# EAGLE design rev3 (EAGLE 7.2.0)
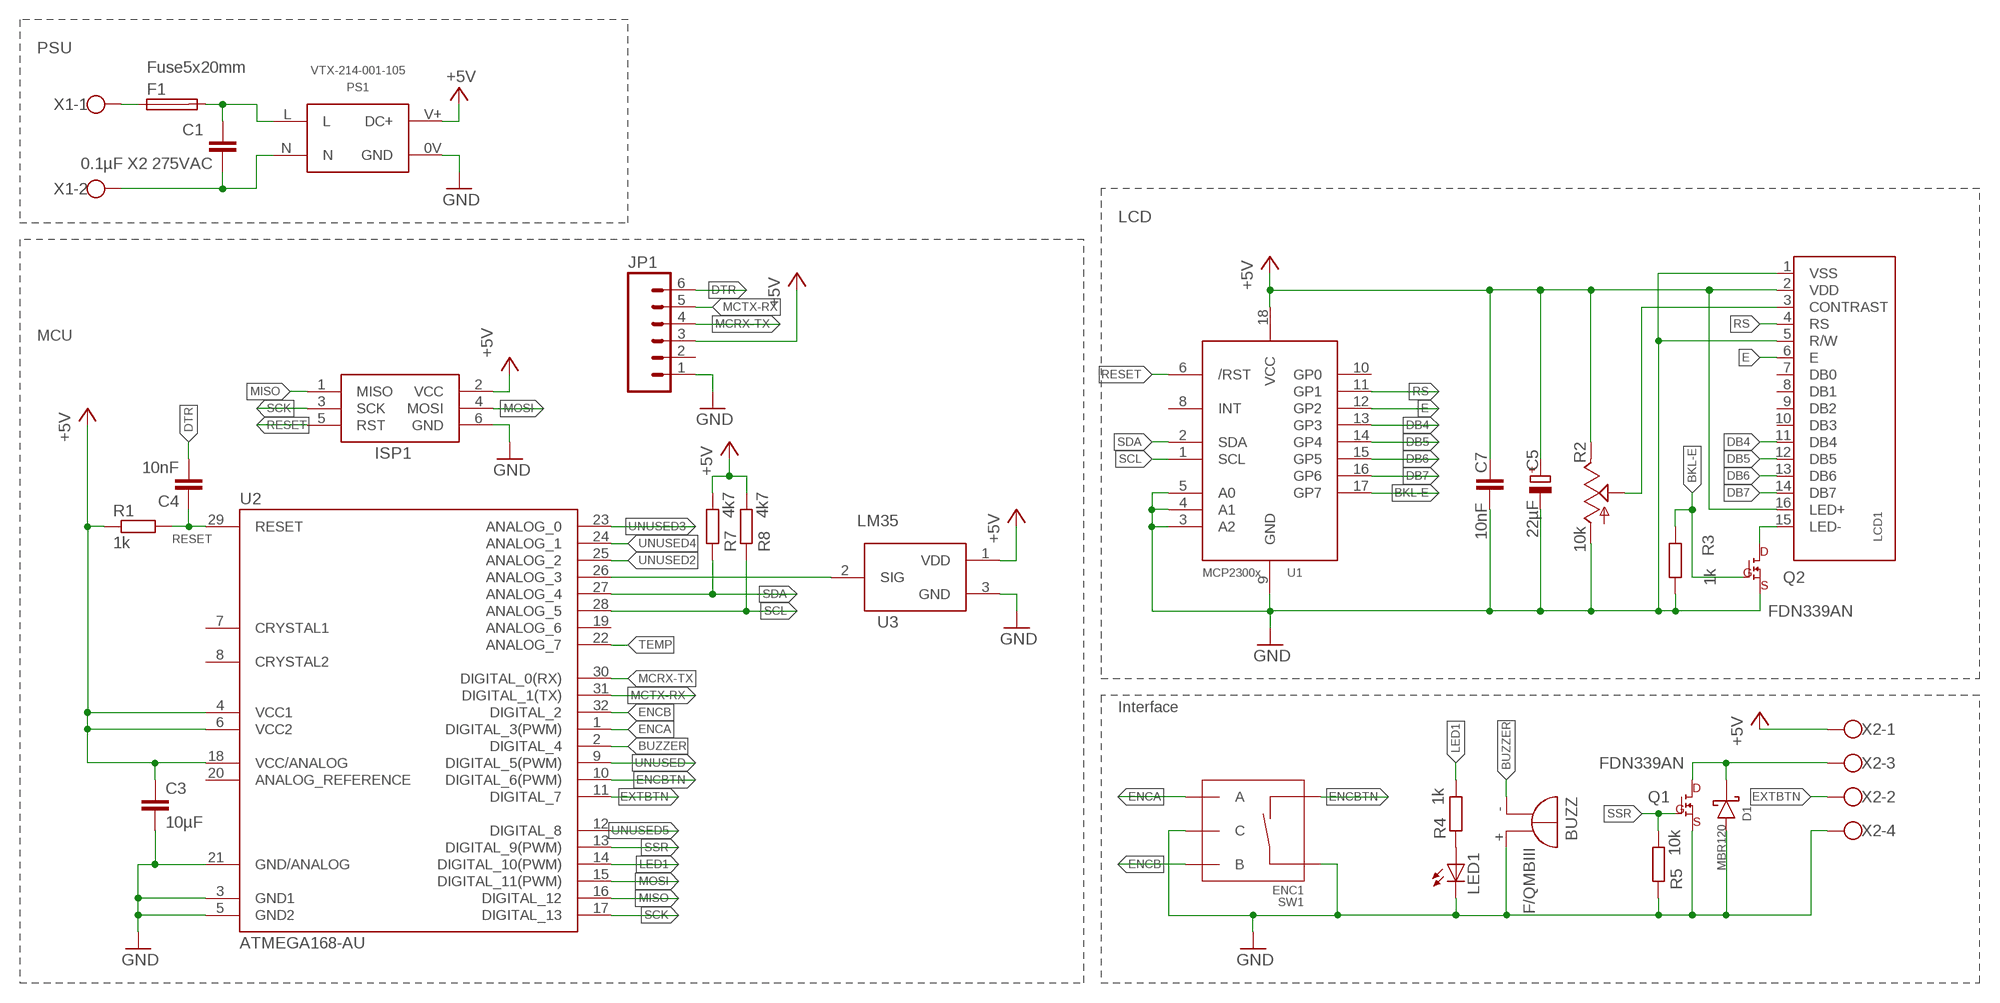
[diagram p0: schematic, sheet 1]

## Parts
BUZZ  F/QMBIII  [F/QMBIII]
C1  0.1µF X2 275VAC  C-EU102-064X133  [C102-064X133]
C3  10µF  C-EUC3216  [C3216]
C4  10nF  C-EUC1206K  [C1206K]
C5  22µF  CPOL-EUE2,5-6E  [E2,5-6E]
C7  10nF  C-EUC1206K  [C1206K]
D1  MBR120  [SOD-123FL]
F1  Fuse5x20mm  FUSEBLANK_5X20MM  [FUSE_HOLDER_5X20MM]
ISP1  AVRISP-6  [AVRISP]
JP1  M06LOCK  [1X06_LOCK]
LCD1  HD44780-LCD  [8X2-CHARLCD]
LED1  LED5MM  [LED5MM]
PS1  VTX-214-001-105  [VTX-214-001-]
Q1  FDN339AN  [SOT23]
Q2  FDN339AN  [SOT23]
R1  1k  R-EU_R0603  [R0603]
R2  10k  TRIM_US-B64Y  [B64Y]
R3  1k  R-EU_R0603  [R0603]
R4  1k  R-EU_R0603  [R0603]
R5  10k  R-EU_R0603  [R0603]
R7  4k7  R-EU_R0603  [R0603]
R8  4k7  R-EU_R0603  [R0603]
SW1  ENC1  ROTARTY_ENCODER  [ROTARY_ENC_PLAIN]
U1  MCP2300X/SO  [SO18W]
U2  ATMEGA168-AU  [TQFP32-08]
U3  LM35  [TO92-]
X1  W237-113  [W237-113]
X2  W237-4  [W237-4]

## Nets
+5V: C3.1 C5.+ C7.1 ISP1.2(VCC) JP1.3 LCD1.2(VDD) LCD1.16(LED+) PS1.V+(DC+) R1.1 R2.E R7.2 R8.2 U1.18(VCC) U2.4(VCC1) U2.6(VCC2) U2.18(VCC/ANALOG) U3.1(VDD) X2.1
BKL-E: Q2.1(GATE) R3.1 U1.17(GP7)
BUZZER: BUZZ.-(+) U2.2(DIGITAL_4)
DB4: LCD1.11(DB4) U1.13(GP3)
DB5: LCD1.12(DB5) U1.14(GP4)
DB6: LCD1.13(DB6) U1.15(GP5)
DB7: LCD1.14(DB7) U1.16(GP6)
DTR: C4.2 JP1.6
E: LCD1.6(E) U1.12(GP2)
ENCA: SW1.A U2.1(DIGITAL_3(PWM))
ENCB: SW1.B U2.32(DIGITAL_2)
ENCBTN: SW1.SW- U2.10(DIGITAL_6(PWM))
EXTBTN: U2.11(DIGITAL_7) X2.2
GND: BUZZ.+(-) C3.2 C5.- C7.2 D1.A ISP1.6(GND) JP1.1 LCD1.1(VSS) LCD1.5(R/W) LED1.K(C) PS1.0V(GND) Q1.2(SOURCE) Q2.2(SOURCE) R2.A R3.2 R5.1 SW1.C SW1.SW+ U1.3(A2) U1.4(A1) U1.5(A0) U1.9(GND) U2.3(GND1) U2.5(GND2) U2.21(GND/ANALOG) U3.3(GND) X2.4
LED1: R4.2 U2.14(DIGITAL_10(PWM))
MCRX-TX: JP1.4 U2.30(DIGITAL_0(RX))
MCTX-RX: JP1.5 U2.31(DIGITAL_1(TX))
MISO: ISP1.1(MISO) U2.16(DIGITAL_12)
MOSI: ISP1.4(MOSI) U2.15(DIGITAL_11(PWM))
N$1: LCD1.3(CONTRAST) R2.S
N$2: F1.1 X1.1
N$3: C1.1 F1.2 PS1.L
N$4: LCD1.15(LED-) Q2.3(DRAIN)
N$5: U2.26(ANALOG_3) U3.2(SIG)
N$6: LED1.A R4.1
N$7: C1.2 PS1.N X1.2
N$8: D1.C Q1.3(DRAIN) X2.3
RESET: C4.1 ISP1.5(RST) R1.2 U1.6(/RST) U2.29(RESET)
RS: LCD1.4(RS) U1.11(GP1)
SCK: ISP1.3(SCK) U2.17(DIGITAL_13)
SCL: R8.1 U1.1(SCL) U2.28(ANALOG_5)
SDA: R7.1 U1.2(SDA) U2.27(ANALOG_4)
SSR: Q1.1(GATE) R5.2 U2.13(DIGITAL_9(PWM))
TEMP: U2.22(ANALOG_7)
UNUSED: U2.9(DIGITAL_5(PWM))
UNUSED2: U2.25(ANALOG_2)
UNUSED3: U2.23(ANALOG_0)
UNUSED4: U2.24(ANALOG_1)
UNUSED5: U2.12(DIGITAL_8)
Unconnected: JP1.2 LCD1.7(DB0) LCD1.8(DB1) LCD1.9(DB2) LCD1.10(DB3) U1.8(INT) U1.10(GP0) U2.7(CRYSTAL1) U2.8(CRYSTAL2) U2.19(ANALOG_6) U2.20(ANALOG_REFERENCE)

## Notes on the sheet
- PSU
- LCD
- MCU
- Interface

## Library data of the parts
BUZZ = buzzer:F/QMBIII: BUZZER Source: Buerklin; OC_FARNELL: unknown; OC_NEWARK: unknown
C1 C3 C4 C7 = resistor:C-EU: CAPACITOR, European symbol
C5 = resistor:CPOL-EU: POLARIZED CAPACITOR, European symbol
D1 = Custom-parts:MBR120
F1 = fuse:FUSE: Fuse; OC_FARNELL: unknown; OC_NEWARK: unknown
ISP1 = adafruit:AVRISP: AVR ISP HEADER Standard 6 pin header for AVR programming
JP1 = SparkFun-Connectors:M06: Header 6 Standard 6-pin 0.1" header. Use with straight break away headers (SKU : PRT-00116), right angle break away headers (PRT-00553), swiss pins (PRT-00743), machine pins (PRT-00117), and female headers (PRT-00115). Molex polarized connector foot print use with SKU : PRT-08094 with associated crimp pins and housings. NOTES ON THE VARIANTS LOCK and LOCK_LONGPADS... This footprint was designed to help hold the alignment of a through-hole component (i.e. 6-pin header) while soldering it into place. You may notice that each hole has been shifted either up or down by 0.005 of an inch from it's more standard position (which is a perfectly straight line). This slight alteration caused the pins (the squares in the middle) to touch the edges of the holes. Because they are alternating, it causes a "brace" to hold the component in place. 0.005 has proven to be the perfect amount of "off-center" position when using our standard breakaway headers. Although looks a little odd when you look at the bare footprint, once you have a header in there, the alteration is very hard to notice. Also, if you push a header all the way into place, it is covered up entirely on the bottom side. This idea of altering the position of holes to aid alignment will be further integrated into the Sparkfun Library for other footprints. It can help hold any component with 3 or more connection pins.
LCD1 = Custom-parts:HD44780-LCD
LED1 = adafruit:LED: LED OSRAM: - CHIPLED LG R971, LG N971, LY N971, LG Q971, LY Q971, LO R971, LY R971 LH N974, LH R974 LS Q976, LO Q976, LY Q976 LO Q996 - Hyper CHIPLED LW Q18S LB Q993, LB Q99A, LB R99A - SideLED LS A670, LO A670, LY A670, LG A670, LP A670 LB A673, LV A673, LT A673, LW A673 LH A674 LY A675 LS A676, LA A676, LO A676, LY A676, LW A676 LS A679, LY A679, LG A679 - Hyper Micro SIDELED® LS Y876, LA Y876, LO Y876, LY Y876 LT Y87S - SmartLED LW L88C, LW L88S LB L89C, LB L89S, LG L890 LS L89K, LO L89K, LY L89K LS L896, LA L896, LO L896, LY L896 - TOPLED LS T670, LO T670, LY T670, LG T670, LP T670 LSG T670, LSP T670, LSY T670, LOP T670, LYG T670 LG T671, LOG T671, LSG T671 LB T673, LV T673, LT T673, LW T673 LH T674 LS T676, LA T676, LO T676, LY T676, LB T676, LH T676, LSB T676, LW T676 LB T67C, LV T67C, LT T67C, LS T67K, LO T67K, LY T67K, LW E67C LS E67B, LA E67B, LO E67B, LY E67B, LB E67C, LV E67C, LT E67C LW T67C LS T679, LY T679, LG T679 LS T770, LO T770, LY T770, LG T770, LP T770 LB T773, LV T773, LT T773, LW T773 LH T774 LS E675, LA E675, LY E675, LS T675 LS T776, LA T776, LO T776, LY T776, LB T776 LHGB T686 LT T68C, LB T68C - Hyper Mini TOPLED® LB M676 - Mini TOPLED Santana® LG M470 LS M47K, LO M47K, LY M47K Source: http://www.osram.convergy.de/
PS1 = Custom-parts:VTX-214-001-
Q1 Q2 = Custom-parts:FDN339AN
R1 R3-R5 R7 R8 = resistor:R-EU_: RESISTOR, European symbol
R2 = pot:TRIM_US-: POTENTIOMETER
SW1 = SparkFun-Electromechanical:ROTARTY_ENCODER: Simple no LED rotary encoder Example: COM-09117
U1 = adafruit:MCP2300X: MCP23008 Inexpensive i2c i/o expander - 8 general purpose i/o pins with optional pullups
U2 = Arduino-AVR:ATMEGA168
U3 = Custom-parts:LM35
X1 = con-wago-500:W237-113: WAGO SCREW CLAMP; OC_FARNELL: unknown; OC_NEWARK: unknown
X2 = con-wago-500:W237-4: WAGO SCREW CLAMP; OC_FARNELL: unknown; OC_NEWARK: unknown

## Board
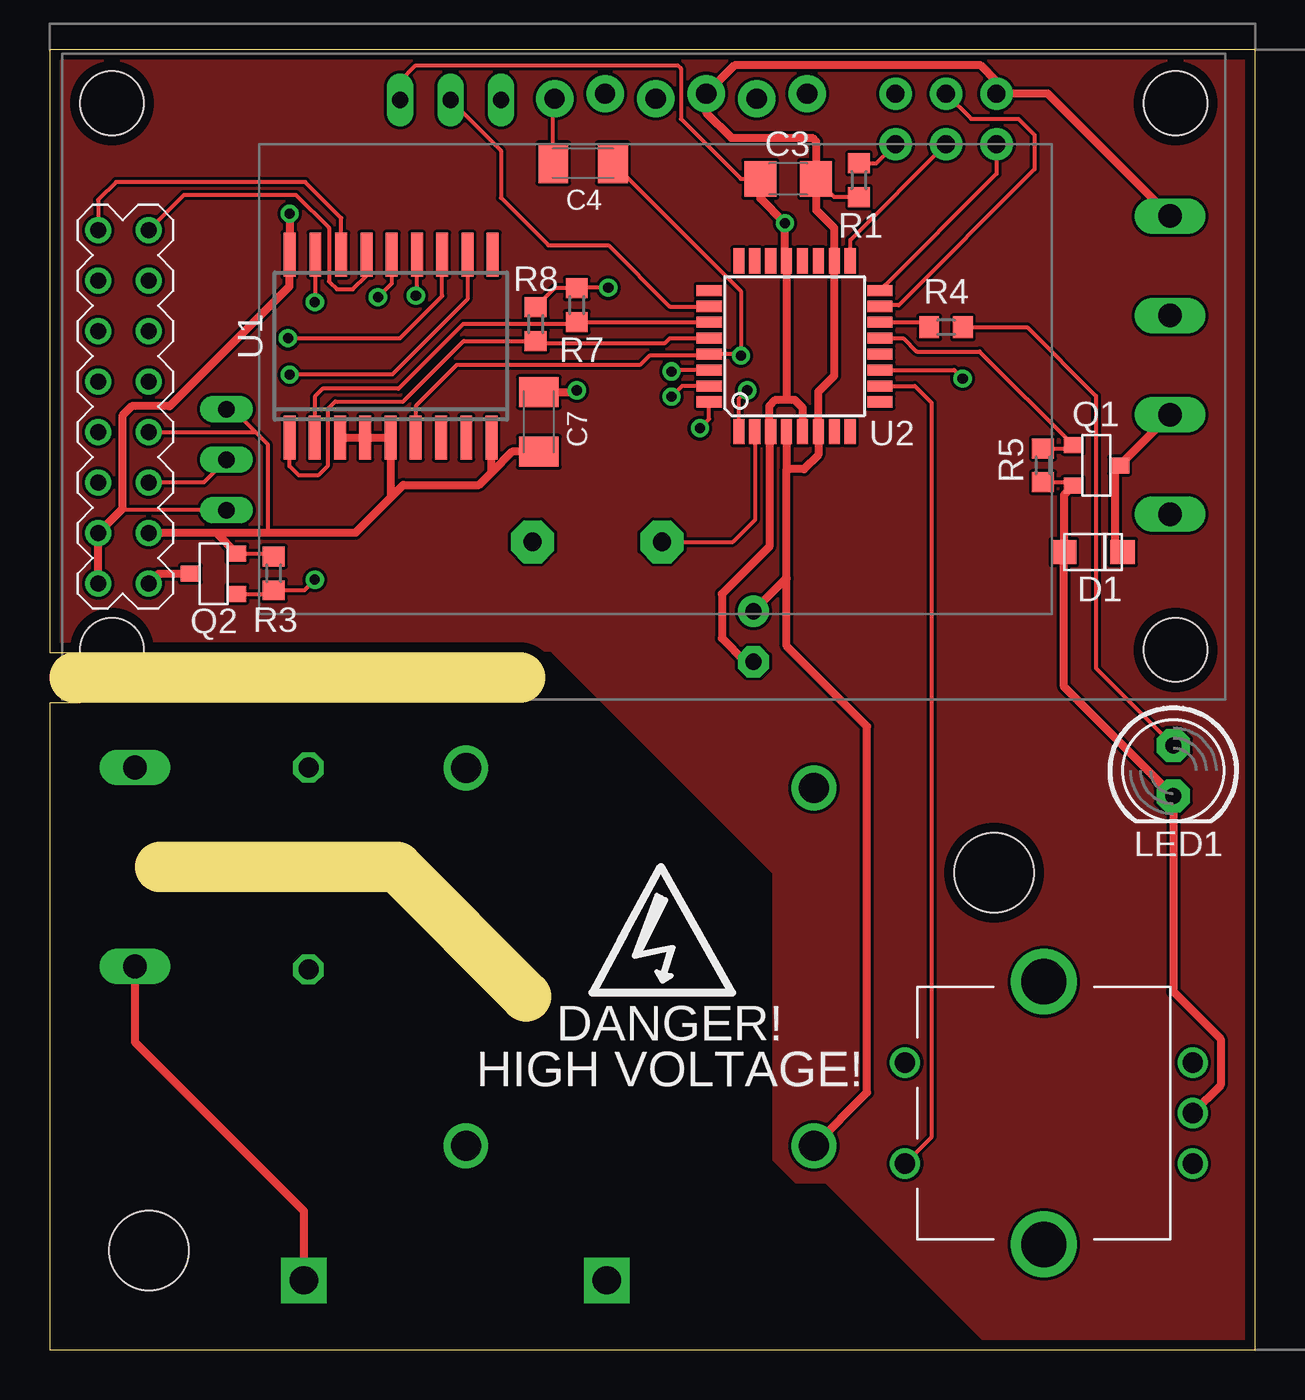
[diagram p1: board, top side]
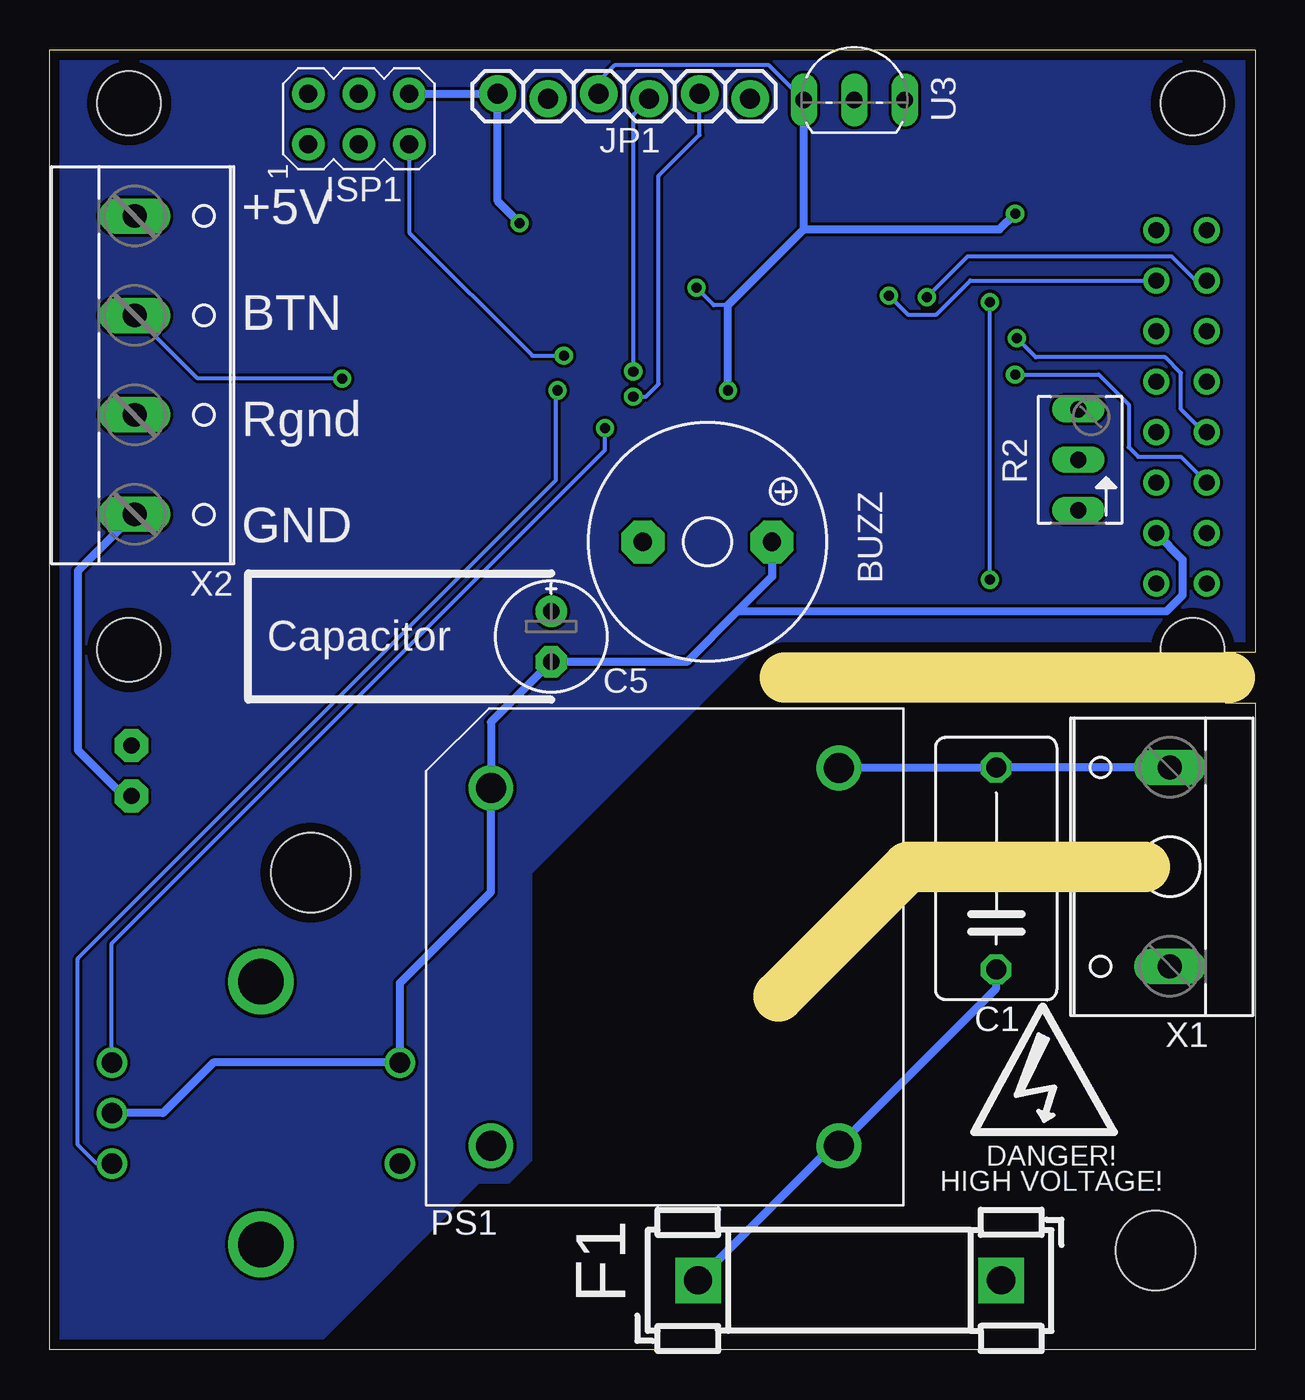
[diagram p2: board, bottom side, seen from below]

Size 60.63 x 65.39 mm. Coordinates in mm from the lower left corner, seen from the top.
Outline: 1.27,33.81 23.65,33.81
Outline: 5.56,24.29 17.46,24.29 23.97,17.78
Outline: 0,0 60.63,0 60.63,65.39 0,65.39 0,35.08 1.51,35.08 1.51,32.54 0,32.54 0,0
Copper layers (1*16): Top 0.035mm / dielectric 1.5mm / Bottom 0.035mm
Design rules "OSH park": minimum track width 6mil, minimum drill 13mil, track to track 6mil, track to pad 6mil, pad to pad 6mil, via to via 6mil, smd to smd 6mil, copper to edge 20mil, drill to drill 16mil, minimum pad ring 10mil, minimum via ring 8mil, stop-mask expansion 4mil, vias tented up to drill 0mil, thermal gap 16mil
Holes 4 mm at 47.5,24 5,5

### Footprints (pad centres in the part's own frame; a part is rotated, then mirrored left to right if it is on the bottom)
F/QMBIII = drill 0.914 pad 2.159 octagon: + 3.251,0; - -3.251,0
C102-064X133 = drill 1.016 octagon: 1 -5.08,0; 2 5.08,0
C3216 = smd 1.6 x 1.8: 1 -1.4,0; 2 1.4,0
C1206K = smd 1.5 x 2: 1 -1.5,0; 2 1.5,0
E2,5-6E = drill 0.813 pad 1.575: + -1.27,0 | drill 0.813 pad 1.575 octagon: - 1.27,0
SOD-123FL = smd 1.25 x 1.22: A 1.475,0; C -1.475,0
FUSE_HOLDER_5X20MM = drill 1.422 pad 2.286 square: 1 0,0; 2 15.24,0
AVRISP = drill 0.9 pad 1.626: 1 -1.27,2.54; 2 1.27,2.54; 3 -1.27,0; 4 1.27,0; 5 -1.27,-2.54; 6 1.27,-2.54
1X06_LOCK = drill 1.016 pad 1.88: 1 0,0; 2 2.54,-0.254; 3 5.08,0; 4 7.62,-0.254; 5 10.16,0; 6 12.7,-0.254
8X2-CHARLCD = drill 0.8: 1 4.34,8.38; 2 1.8,8.38; 3 4.34,10.92; 4 1.8,10.92; 5 4.34,13.46; 6 1.8,13.46; 7 4.34,16; 8 1.8,16; 9 4.34,18.54; 10 1.8,18.54; 11 4.34,21.08; 12 1.8,21.08; 13 4.34,23.62; 14 1.8,23.62; 15 4.34,5.84; 16 1.8,5.84 | hole 3.2: 2.5,2.5; 2.5,30; 56,2.5; 56,30
LED5MM = drill 0.813 pad 1.676 octagon: A -1.27,0; K 1.27,0
VTX-214-001- = drill 1.5: 0V 8.5,8.75; L -9.5,-8.75; N 9.5,-8.75; V+ -9.5,8.75
SOT23 = smd 0.8 x 0.95: 1 -1.031,-1.159; 2 1.009,-1.159; 3 -0.011,1.181
R0603 = smd 1 x 1.1: 1 -0.85,0; 2 0.85,0
B64Y = drill 0.813 long: A 2.54,0; E -2.54,0; S 0,0
ROTARY_ENC_PLAIN = drill 1.016: A 7.493,-2.54; B 7.493,2.54; C 7.493,0; SW+ -6.985,2.54; SW- -6.985,-2.54 | drill 2.286: P$3 0,6.604; P$4 0,-6.604
SO18W = smd 0.6 x 2.2: 1 -4.445,-4.6; 2 -3.175,-4.6; 3 -1.905,-4.6; 4 -0.635,-4.6; 5 0.635,-4.6; 6 1.905,-4.6; 7 3.175,-4.6; 8 4.445,-4.6; 9 5.715,-4.6; 10 5.775,4.6; 11 4.505,4.6; 12 3.235,4.6; 13 1.965,4.6; 14 0.695,4.6; 15 -0.575,4.6; 16 -1.845,4.6; 17 -3.145,4.6; 18 -4.445,4.6
TQFP32-08 = smd 1.27 x 0.559: 1 -4.293,2.8; 2 -4.293,2; 3 -4.293,1.2; 4 -4.293,0.4; 5 -4.293,-0.4; 6 -4.293,-1.2; 7 -4.293,-2; 8 -4.293,-2.8; 17 4.293,-2.8; 18 4.293,-2; 19 4.293,-1.2; 20 4.293,-0.4; 21 4.293,0.4; 22 4.293,1.2; 23 4.293,2; 24 4.293,2.8 | smd 0.559 x 1.27: 9 -2.8,-4.293; 10 -2,-4.293; 11 -1.2,-4.293; 12 -0.4,-4.293; 13 0.4,-4.293; 14 1.2,-4.293; 15 2,-4.293; 16 2.8,-4.293; 25 2.8,4.293; 26 2,4.293; 27 1.2,4.293; 28 0.4,4.293; 29 -0.4,4.293; 30 -1.2,4.293; 31 -2,4.293; 32 -2.8,4.293
TO92- = drill 0.813 long: 1 -2.54,0; 2 0,0; 3 2.54,0
W237-113 = drill 1.194 long: 1 -5,-1.27; 2 5,-1.27
W237-4 = drill 1.194 long: 1 -7.5,-1.27; 2 -2.5,-1.27; 3 2.5,-1.27; 4 7.5,-1.27

### Placement (x,y rotation side)
BUZZ  27.54,40.64 0 bottom
C1  13.02,24.21 90 bottom
C3  37.15,58.9 180 top
C4  26.83,59.69 180 top
C5  35.4,35.88 270 bottom
C7  24.61,46.67 270 top
D1  52.49,40.13 180 top
F1  12.78,3.49 180 bottom
ISP1  45.09,61.91 90 bottom
JP1  38.1,63.18 0 bottom
LCD1  0.64,32.7 0 top
LED1  56.52,29.13 270 top
PS1  29.69,19.76 90 bottom
Q1  52.64,44.48 270 top
Q2  8.26,39.05 90 top
R1  40.71,58.83 90 top
R2  8.89,44.77 90 bottom
R3  11.27,39.05 90 top
R4  45.09,51.44 180 top
R5  49.96,44.49 90 top
R7  26.51,52.55 90 top
R8  24.45,51.59 90 top
SW1  50.01,11.91 0 top
U1  16.51,50.48 0 top
U2  37.47,50.48 90 top
U3  20.16,62.87 0 bottom
X1  5.56,24.29 90 bottom
X2  55.09,49.53 270 bottom

### Tracks (layer width: path | path; a pad name or v marks a point on that pad's centre or on a via)
+5V  (via drill 0.51)
  Top 0.203: R2.E 3.72,42.23 3.65,42.3 | R8.2 25.4,53.4 R7.2 26.53,53.42 v28.1,53.42 | 10.16,51.59 10,51.44 | R1.1 39.46,57.98 C3.1
  Top 0.406: LCD1.16 LCD1.2 3.65,42.3 3.65,46.99 4.13,47.47 6.03,47.47 10,51.44 12.06,53.5 U1.18 v12.06,57.15 | U2.4 37.06,44.29 | 37.06,44.29 37.94,44.29 38.66,45.02 U2.6 38.66,48.19 39.47,48.99 U2.18 39.47,56.42 38.55,57.34 C3.1 38.55,60.77 38.36,60.96 34.29,60.96 33.02,62.23 JP1.3 34.45,64.61 46.83,64.61 47.62,63.82 ISP1.2 50.2,63.18 X2.1 | C7.1 26.42,48.17 v26.51,48.26 | C5.+ 37.06,38.81 | 37.06,38.81 37.06,44.29 | PS1.V+ 41.12,12.94 41.12,31.35 37.06,35.4 37.06,38.81
  Bottom 0.203: U3.1 24.45,64.61 32.23,64.61 33.02,63.82 JP1.3 | 26.51,52.55 27.23,52.55 v28.1,53.42
  Bottom 0.406: v26.51,48.26 26.51,52.55 22.7,56.36 | 22.7,56.36 12.86,56.36 v12.06,57.15 | 22.7,56.36 U3.1
BKL-E  (via drill 0.51)
  Top 0.203: v13.34,52.7 13.37,52.73 U1.17 | Q2.1 11.09,38.02 R3.1 12.8,38.2 v13.34,38.73
  Bottom 0.203: v13.34,38.73 v13.34,52.7
BUZZER
  Top 0.203: U2.2 35.47,41.74 34.37,40.64 BUZZ.-
DB4  (via drill 0.51)
  Top 0.203: v18.41,53.02 18.48,53.08 U1.13
  Bottom 0.203: v18.41,53.02 17.46,52.07 16.03,52.07 14.32,53.78 LCD1.11
DB5  (via drill 0.51)
  Top 0.203: U1.14 17.2,53.64 v16.51,52.94
  Bottom 0.203: v16.51,52.94 14.45,55.01 4.21,55.01 2.98,53.78 LCD1.12
DB6
  Top 0.203: LCD1.13 6.75,58.1 12.38,58.1 14.05,56.44 14.05,53.74 14.45,53.34 15.24,53.34 15.94,54.03 U1.15
DB7
  Top 0.203: U1.16 14.66,56.93 12.86,58.74 3.33,58.74 2.44,57.84 LCD1.14
DTR
  Top 0.203: C4.2 25.33,62.86 JP1.6
E  (via drill 0.51)
  Top 0.203: v11.99,50.88 17.62,50.88 19.75,53 U1.12
  Bottom 0.203: LCD1.6 2.59,46.16 3.73,47.31 3.73,49.13 4.52,49.93 11.03,49.93 v11.99,50.88
ENCA  (via drill 0.51)
  Top 0.203: U2.1 34.66,47.84 v35.08,48.26
  Bottom 0.203: SW1.A 58.26,9.37 59.21,10.32 59.21,19.68 35.16,43.74 35.16,48.18 v35.08,48.26
ENCB  (via drill 0.51)
  Top 0.203: v32.7,46.35 33.17,46.83 U2.32
  Bottom 0.203: v32.7,46.35 32.7,45.24 57.5,20.45 SW1.B
ENCBTN
  Top 0.203: SW1.SW- 44.37,10.72 44.37,47.62 43.51,48.48 U2.10
EXTBTN  (via drill 0.51)
  Top 0.203: U2.11 45.5,49.28 v45.92,48.86
  Bottom 0.203: X2.2 53.18,48.86 v45.92,48.86
GND  (via drill 0.51)
  Top 0.203: LCD1.5 10.35,46.16 | 10.35,46.16 10.95,45.56 10.95,41.24 11.11,41.08 | R2.A 9.21,47.31 10.35,46.16 | U3.3 17.62,63.82 18.41,64.61 31.59,64.61 31.75,64.45 31.75,61.91 34.77,58.9 C3.2 | Q2.2 11.11,40.06 R3.2 | R5.1 51.31,43.64 Q1.2
  Top 0.406: Q2.2 8.39,41.08 | 8.39,41.08 11.11,41.08 15.37,41.08 17.14,42.86 | U1.3 U1.4 U1.5 17.14,42.86 | 22.23,44.13 21.59,43.5 17.78,43.5 17.14,42.86 | 22.23,44.13 U1.9 | U2.3 36.2,46.26 | 36.2,46.26 36.2,47.47 36.51,47.78 36.99,47.78 | 36.99,47.78 37.47,47.78 37.87,47.38 U2.5 | 36.99,47.78 37.06,47.86 U2.21 36.99,54.85 v36.99,56.67 35.75,57.91 C3.2 | C7.2 23.27,45.17 22.23,44.13 | 8.39,41.08 LCD1.1 | SW1.C 58.9,13.3 58.9,15.64 56.52,18.02 LED1.K 51.01,33.36 D1.A 51.01,43 Q1.2 | 36.2,46.26 36.2,40.4 33.81,38.02 33.81,35.8 35,34.61 C5.-
  Bottom 0.406: v36.99,56.67 38.1,57.78 JP1.1 ISP1.6 | LCD1.1 3.65,39.76 3.65,37.94 4.45,37.15 26.04,37.15 | SW1.C 54.93,11.91 52.39,14.45 SW1.SW+ 43.02,18.44 38.44,23.03 PS1.0V 38.44,31.57 C5.- 28.57,34.61 26.04,37.15 | LED1.K 56.91,27.86 59.21,30.16 59.21,39.17 X2.4 | BUZZ.+ 24.29,38.89 26.04,37.15
GNDDDD
  pour Top: 0,65.41 60.64,65.41 60.64,0 47.47,0 39.05,8.41 37.54,8.41 36.43,9.53 36.43,23.97 25.4,35 25.24,35.16 0,35.16
  pour Bottom: 0,65.41 0,35.16 25.24,35.16 36.43,23.97 36.43,9.53 37.54,8.41 39.05,8.41 47.47,0 60.64,0 60.64,65.41
LED1
  Top 0.203: U2.14 43.99,51.68 R4.2
MCRX-TX  (via drill 0.51)
  Top 0.203: U2.30 31.34,49.28 v31.27,49.21
  Bottom 0.203: v31.27,49.21 31.27,62.13 JP1.4
MCTX-RX  (via drill 0.51)
  Top 0.203: U2.31 31.81,48.48 v31.27,47.94
  Bottom 0.203: v31.27,47.94 30.64,47.94 30,48.58 30,59.05 27.94,61.12 JP1.5
MISO
  Top 0.203: 42.07,53.59 U2.16 47.62,59.15 ISP1.1
MOSI
  Top 0.203: ISP1.4 46.35,61.91 48.74,61.91 49.53,61.12 49.53,59.37 42.7,52.55 41.82,52.55 U2.15
N$1
  Top 0.203: R2.S 7.75,43.62 LCD1.3
N$2
  Top 0.406: X1.1 4.29,15.48 12.78,6.99 F1.1
N$3
  Bottom 0.406: F1.2 21.25,10.26 PS1.L 13.02,18.18 C1.1
N$4
  Top 0.406: LCD1.15 5.47,39.04 Q2.3
N$5
  Top 0.203: U3.2 22.7,60.33 22.7,57.94 25.08,55.56 28.1,55.56 31.18,52.48 U2.26
N$6
  Top 0.203: LED1.A 52.63,34.29 52.63,47.98 49.17,51.44 R4.1
N$7
  Bottom 0.406: X1.2 C1.2 13.04,29.26 PS1.N
N$8
  Top 0.406: X2.3 Q1.3 53.57,44.23 53.57,40.64 53.96,40.24 D1.C
RESET  (via drill 0.51)
  Top 0.203: U1.6 18.41,47.47 20.48,49.53 29.69,49.53 30.16,50.01 33.1,50.01 U2.29 34.69,50.08 v34.77,50.01 34.77,53.25 C4.1 | R1.2 41.58,59.68 ISP1.5
  Bottom 0.203: v34.77,50.01 36.35,50.01 42.55,56.2 ISP1.5
RS  (via drill 0.51)
  Top 0.203: U1.11 21.02,52.84 17.22,49.05 v12.06,49.05
  Bottom 0.203: v12.06,49.05 7.86,49.05 6.35,47.55 6.35,45.4 5.87,44.93 3.74,44.93 LCD1.4
SCK
  Top 0.203: U2.17 40.27,55.82 ISP1.3
SCL
  Top 0.203: U2.28 31.2,50.88 30.96,50.64 24.55,50.64 R8.1 20.82,50.74 17.78,47.7 14.37,47.7 13.97,47.31 13.97,44.45 13.49,43.97 12.54,43.97 12.06,44.45 U1.1
SDA
  Top 0.203: U2.27 26.52,51.68 R7.1 26.41,51.59 20.8,51.59 17.54,48.34 13.73,48.34 13.34,47.94 U1.2
SSR
  Top 0.203: U2.13 42.93,50.88 43.6,50.22 46.77,50.22 Q1.1 51.31,45.34 R5.2

### Text on the board
tPlace: DANGER! | HIGH VOLTAGE!
bPlace: +5V / / BTN / / Rgnd / / GND | Capacitor | DANGER! | HIGH VOLTAGE!